# Altium project BOTS.PrjPCB
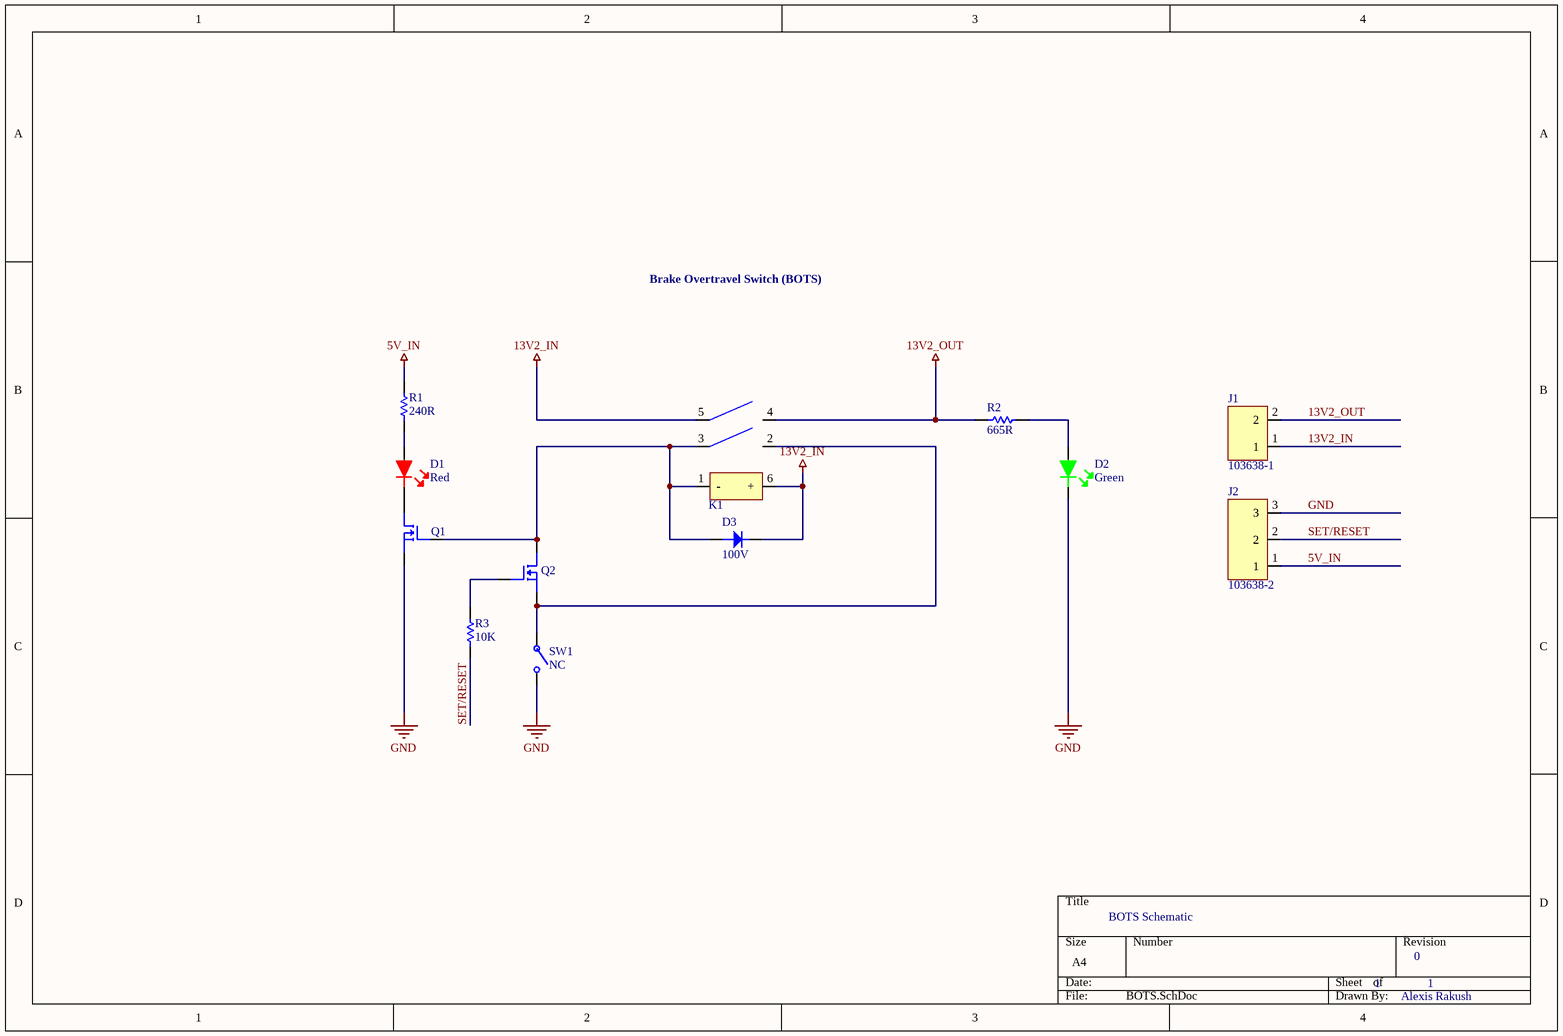
[diagram p0: BOTS.SchDoc]
1 sheet, 12 parts. Net scope: global (net labels, ports and power ports of the same name join across sheets).
Board file: BOTS.PcbDoc

## Sheet BOTS.SchDoc
size A4; Organization: Altium Limited; Address1: L3, 12a Rodborough Rd; Address2: Frenchs Forest; Address3: NSW; Address4: Australia 2086

### Parts
D1  Red  [LED-0603]
D2  Green  [LED-0603]
D3  100V  [DO-214AA]
J1  103638-1  [2PIN]
J2  103638-2  [3PIN]
K1  5-1419124-6  [RELAY DPST SDC]  (value not drawn)
Q1  DMN6140L-13DICT-ND  [SOT-23-3]  (value not drawn)
Q2  DMN6140L-13DICT-ND  [SOT-23-3]  (value not drawn)
R1  240R  [RES-0402]
R2  665R  [RES-0402]
R3  10K  [RES-0603]
SW1  NC  [Switch]

### Nets
5V_IN: J2.1 R1.2
13V2_IN: D3.1 J1.1 K1.5 K1.6(+)
13V2_OUT: J1.2 K1.4 R2.1
GND: D2.2 J2.3 Q1.3 SW1.2
SET/RESET: J2.2 R3.1
NetD1_1: D1.1 R1.1
NetD1_2: D1.2 Q1.2
NetD2_1: D2.1 R2.2
NetD3_2: D3.2 K1.1(-) K1.3 Q1.1 Q2.2
NetK1_2: K1.2 Q2.3 SW1.1
NetQ2_1: Q2.1 R3.2

### Notes on the sheet
- Brake Overtravel Switch (BOTS)
- BOTS Schematic
- 1
- 0
- Alexis Rakush
- Title
- Size:
- Date:
- A4
- Number:
- Time:
- Revision:
- Sheet
- of
- File:

### Library data of the parts
D1 = LED-Red: LED RED CLEAR 0603 SMD; Manufacturer: Wurth Electronics; Manufacturer Part Number: 150060RS75000; Viewing Angle: 140°; Lens Style: Clear,Rectangular; Luminous Intensity: 250mcd; Forward Current: 30mA; Forward Voltage: 2V; Wavelength: 625nm; Test Current: 20mA; Supplier 1: Digi-Key; Stock 1: 18518; Pricing 1: 1=0.14, 50=0.133, 100=0.114, 500=0.099 (USD); Mount: Surface Mount; Case/Package: 0603; Color: Red; Case Code (Metric): 1608; Case Code (Imperial): 0603; Min Operating Temperature: -40°C; Max Operating Temperature: 85°C; Package Quantity: 1; Packaging: Cut Tape; Dominant Wavelength: 625nm; Length: 1.6mm; Height: 0.7mm; Width: 0.8mm; REACH SVHC: Unknown; ComponentLink1URL: https://katalog.we-online.de/led/datasheet/150060RS75000.pdf?src-supplier=Digi-Key; ComponentLink1Description: https://katalog.we-online.de/led/datasheet/150060RS75000.pdf?src-supplier=Digi-Key; ComponentLink2URL: http://www.produktinfo.conrad.com/datenblaetter/750000-774999/759428-da-01-en-CHIPLED_0603_W_KL_ROT_150060RS75000.pdf?src-supplier=Conrad; ComponentLink2Description: http://www.produktinfo.conrad.com/datenblaetter/750000-774999/759428-da-01-en-CHIPLED_0603_W_KL_ROT_150060RS75000.pdf?src-supplier=Conrad; Supplier Part Number 1: 732-4978-6-ND
D2 = LED-Green: LED GREEN CLEAR 0603 SMD; Manufacturer: Wurth Electronics; Manufacturer Part Number: 150060VS75000; Luminous Intensity: 40mcd; Viewing Angle: 140°; Forward Voltage: 2V; Wavelength: 570nm; Lens Style: Clear,Rectangular; Forward Current: 30mA; Test Current: 20mA; Supplier 1: Digi-Key; Stock 1: 118118; Pricing 1: 1=0.14, 50=0.133, 100=0.114, 500=0.099 (USD); Mount: Surface Mount; Case/Package: 0603; Number of Pins: 2; Color: Green; Case Code (Metric): 1608; Case Code (Imperial): 0603; Min Operating Temperature: -40°C; Max Operating Temperature: 85°C; Package Quantity: 1; Packaging: Tape and Reel; Dominant Wavelength: 570nm; Length: 1.6mm; Height: 0.7mm; Width: 0.8mm; REACH SVHC: Unknown; ComponentLink1URL: https://katalog.we-online.de/led/datasheet/150060VS75000.pdf?src-supplier=Digi-Key; ComponentLink1Description: https://katalog.we-online.de/led/datasheet/150060VS75000.pdf?src-supplier=Digi-Key; Supplier Part Number 1: 732-4980-1-ND
D3 = Diode-100V-3A: DIODE GEN PURP 100V 3A DO214AA; Manufacturer: MCC; Manufacturer Part Number: S3BB-TP; Max Surge Current: 100A; Forward Voltage: 1.15V; Peak Reverse Current: 10uA; Element Configuration: Single; Supplier 1: Digi-Key; Stock 1: 9444; Pricing 1: 1=0.46, 10=0.376, 25=0.344, 100=0.216, 250=0.2136, 500=0.2, 1000=0.136 (USD); Mount: Surface Mount; Number of Pins: 2; Packaging: Tape and Reel; Package Quantity: 1; Average Rectified Current: 3A; Peak Non-Repetitive Surge Current: 100A; Max Repetitive Reverse Voltage (Vrrm): 100V; Reverse Voltage: 100V; Max Reverse Voltage (DC): 100V; Radiation Hardening: No; Lead Free: Lead Free; ComponentLink1URL: http://www.mccsemi.com/up_pdf/S3AB-S3MB(SMB).PDF?src-supplier=Digi-Key; ComponentLink1Description: http://www.mccsemi.com/up_pdf/S3AB-S3MB(SMB).PDF?src-supplier=Digi-Key; ComponentLink2URL: https://www.verical.com/server-webapp/html/getDatasheet?partID=686538&src-supplier=Verical; ComponentLink2Description: https://www.verical.com/server-webapp/html/getDatasheet?partID=686538&src-supplier=Verical; ComponentLink3URL: http://www.mccsemi.com/up_pdf/S3AB-S3MB(SMB).PDF?src-supplier=Future+Electronics; ComponentLink3Description: http://www.mccsemi.com/up_pdf/S3AB-S3MB(SMB).PDF?src-supplier=Future+Electronics; Supplier Part Number 1: S3BB-TPMSDKR-ND
J1 = 2PIN: CONN HEADER VERT 2POS 2.54MM; Manufacturer: TE Connectivity; Current Rating: 3A; Number of Contacts: 2; Connector Type: Plug,Header,Pin; Insulation Resistance: 5GR; Backwall/Post Interruptions: No (Without); Contact Retention: Yes (With); PCB Mount Retention: Without; PCB Mounting Orientation: Vertical; Contact Resistance: 15mR; Gender: Male; Voltage Rating: 600V; Row Spacing: 0.1inch; Plating Thickness: 2.54um; Tail Length: 3.3mm; Approvals: CSA; Supplier 1: Digi-Key; Manufacturer Part Number: 103638-1; Stock 1: 3265; Pricing 1: 1=0.77, 10=0.725, 100=0.5555, 500=0.48306, 1000=0.39852, 5000=0.35022, 10000=0.32607 (USD); Mount: Through Hole; Color: Black; Contact Plating: Gold,Tin,Lead,Matte; Contact Material: Brass; Housing Material: Thermoplastic; Housing Color: Black; Contact Shape: Square; Min Operating Temperature: -65°C; Max Operating Temperature: 105°C; Package Quantity: 72; Packaging: Rail/Tube; Termination: Crimp; Series: AMPMODU MTE; Number of Rows: 1; Orientation: Straight; Contact Gender: Male; Number of Positions: 2; Contact Current Rating: 3A; Mating Alignment: Yes (With); Mating Retention: Yes (With); PCB Mount Alignment: No (Without); Strain Relief: No (Without); Contact Type: Male Pin; Length: 7.62mm; Width: 0.3inch; Height: 13.59mm; Depth: 6.98mm; Pitch: 2.54mm; Contact Mating Length: 0.23inch; Radiation Hardening: No; Flammability Rating: UL94 V-0; ELV: Non-Compliant; Lead Free: Contains Lead; REACH SVHC: No SVHC; ComponentLink1URL: http://www.te.com/commerce/DocumentDelivery/DDEController?Action=showdoc&DocId=Data+Sheet%7F4-1773458-0_AMPMODU_MTE_INTERCONNECT_SYS%7F0810%7Fpdf%7FEnglish%7FENG_DS_4-1773458-0_AMPMODU_MTE_INTERCONNECT_SYS_0810.pdf%7F104363-8&src-supplier=Avnet; ComponentLink1Description: http://www.te.com/commerce/DocumentDelivery/DDEController?Action=showdoc&DocId=Data+Sheet%7F4-1773458-0_AMPMODU_MTE_INTERCONNECT_SYS%7F0810%7Fpdf%7FEnglish%7FENG_DS_4-1773458-0_AMPMODU_MTE_INTERCONNECT_SYS_0810.pdf%7F104363-8&src-supplier=Avnet; ComponentLink2URL: http://www.te.com/commerce/DocumentDelivery/DDEController?Action=showdoc&DocId=Data+Sheet%7F4-1773458-0_AMPMODU_MTE_INTERCONNECT_SYS%7F0411%7Fpdf%7FEnglish%7FENG_DS_4-1773458-0_AMPMODU_MTE_INTERCONNECT_SYS_0411.pdf%7F103638-1&src-supplier=Future+Electronics; ComponentLink2Description: http://www.te.com/commerce/DocumentDelivery/DDEController?Action=showdoc&DocId=Data+Sheet%7F4-1773458-0_AMPMODU_MTE_INTERCONNECT_SYS%7F0411%7Fpdf%7FEnglish%7FENG_DS_4-1773458-0_AMPMODU_MTE_INTERCONNECT_SYS_0411.pdf%7F103638-1&src-supplier=Future+Electronics; ComponentLink3URL: https://www.verical.com/server-webapp/html/getDatasheet?partID=237168&src-supplier=Verical; ComponentLink3Description: https://www.verical.com/server-webapp/html/getDatasheet?partID=237168&src-supplier=Verical; ComponentLink4URL: https://www.alliedelec.com/m/d/454cd58767cb456274f3716a0303ed50.pdf?src-supplier=Allied+Electronics; ComponentLink4Description: https://www.alliedelec.com/m/d/454cd58767cb456274f3716a0303ed50.pdf?src-supplier=Allied+Electronics; ComponentLink5URL: http://www.jameco.com/Jameco/Products/ProdDS/738013.pdf?src-supplier=Jameco; ComponentLink5Description: http://www.jameco.com/Jameco/Products/ProdDS/738013.pdf?src-supplier=Jameco; ComponentLink6URL: https://www.te.com/commerce/DocumentDelivery/DDEController?Action=srchrtrv&amp;DocNm=103638&amp;DocType=Customer+Drawing&amp;DocLang=English&src-supplier=Digi-Key; ComponentLink6Description: https://www.te.com/commerce/DocumentDelivery/DDEController?Action=srchrtrv&amp;DocNm=103638&amp;DocType=Customer+Drawing&amp;DocLang=English&src-supplier=Digi-Key; Supplier Part Number 1: A28524-ND
J2 = 3PIN: CONN HEADER VERT 3POS 2.54MM; Manufacturer: TE Connectivity; Number of Positions: 3; Insulation Resistance: 5GR; Current Rating: 3A; Connector Type: Plug,Header,Pin; Mating Alignment: Yes (With); Backwall/Post Interruptions: No (Without); PCB Mount Retention: Without; PCB Mounting Orientation: Vertical; Contact Resistance: 15mR; Gender: Male; Voltage Rating: 267V; Row Spacing: 0.1inch; Plating Thickness: 2.54um; Tail Length: 3.3mm; Approvals: CSA; Supplier 1: Digi-Key; Manufacturer Part Number: 103638-2; Stock 1: 0; Pricing 1: 1=0.8, 10=0.7, 100=0.6037, 500=0.49394, 1000=0.43905, 5000=0.38417, 10000=0.36496 (USD); Mount: Through Hole; Color: Black; Housing Color: Black; Housing Material: Thermoplastic; Contact Material: Brass; Contact Plating: Gold,Tin,Lead,Matte; Contact Shape: Square; Min Operating Temperature: -65°C; Max Operating Temperature: 105°C; Packaging: Rail/Tube; Number of Rows: 1; Package Quantity: 54; Series: AMPMODU MTE; Termination: Crimp; Number of Contacts: 3; Orientation: Straight; Contact Current Rating: 3A; Mating Retention: Yes (With); Contact Gender: Male; Contact Retention: Yes (With); PCB Mount Alignment: No (Without); Strain Relief: No (Without); Contact Type: Male Pin; Length: 0.4inch; Width: 0.4inch; Height: 13.59mm; Pitch: 2.54mm; Depth: 6.98mm; Contact Mating Length: 0.23inch; Radiation Hardening: No; Flammability Rating: UL94 V-0; ELV: Non-Compliant; Lead Free: Contains Lead; REACH SVHC: No SVHC; RoHS Compliant: No; ComponentLink1URL: http://www.te.com/commerce/DocumentDelivery/DDEController?Action=showdoc&DocId=Data+Sheet%7F4-1773458-0_AMPMODU_MTE_INTERCONNECT_SYS%7F0810%7Fpdf%7FEnglish%7FENG_DS_4-1773458-0_AMPMODU_MTE_INTERCONNECT_SYS_0810.pdf%7F104363-8&src-supplier=Avnet; ComponentLink1Description: http://www.te.com/commerce/DocumentDelivery/DDEController?Action=showdoc&DocId=Data+Sheet%7F4-1773458-0_AMPMODU_MTE_INTERCONNECT_SYS%7F0810%7Fpdf%7FEnglish%7FENG_DS_4-1773458-0_AMPMODU_MTE_INTERCONNECT_SYS_0810.pdf%7F104363-8&src-supplier=Avnet; ComponentLink2URL: http://www1.futureelectronics.com/doc/TYCO%20ELECTRONICS/103638-2.pdf?src-supplier=Future+Electronics; ComponentLink2Description: http://www1.futureelectronics.com/doc/TYCO%20ELECTRONICS/103638-2.pdf?src-supplier=Future+Electronics; ComponentLink3URL: https://www.verical.com/server-webapp/html/getDatasheet?partID=198760&src-supplier=Verical; ComponentLink3Description: https://www.verical.com/server-webapp/html/getDatasheet?partID=198760&src-supplier=Verical; ComponentLink4URL: http://www.te.com/commerce/DocumentDelivery/DDEController?Action=showdoc&DocId=Data+Sheet%7F4-1773458-0_AMPMODU_MTE_INTERCONNECT_SYS%7F0810%7Fpdf%7FEnglish%7FENG_DS_4-1773458-0_AMPMODU_MTE_INTERCONNECT_SYS_0810.pdf%7F104363-8&src-supplier=Avnet+Asia; ComponentLink4Description: http://www.te.com/commerce/DocumentDelivery/DDEController?Action=showdoc&DocId=Data+Sheet%7F4-1773458-0_AMPMODU_MTE_INTERCONNECT_SYS%7F0810%7Fpdf%7FEnglish%7FENG_DS_4-1773458-0_AMPMODU_MTE_INTERCONNECT_SYS_0810.pdf%7F104363-8&src-supplier=Avnet+Asia; ComponentLink5URL: https://www.alliedelec.com/m/d/494b66edc3896904f54da7132ef2a22d.pdf?src-supplier=Allied+Electronics; ComponentLink5Description: https://www.alliedelec.com/m/d/494b66edc3896904f54da7132ef2a22d.pdf?src-supplier=Allied+Electronics; ComponentLink6URL: http://www.jameco.com/Jameco/Products/ProdDS/738021.pdf?src-supplier=Jameco; ComponentLink6Description: http://www.jameco.com/Jameco/Products/ProdDS/738021.pdf?src-supplier=Jameco; ComponentLink7URL: http://www.te.com/commerce/DocumentDelivery/DDEController?Action=srchrtrv&DocNm=103638&DocType=Customer+Drawing&DocLang=English&src-supplier=Digi-Key; ComponentLink7Description: http://www.te.com/commerce/DocumentDelivery/DDEController?Action=srchrtrv&DocNm=103638&DocType=Customer+Drawing&DocLang=English&src-supplier=Digi-Key; Supplier Part Number 1: A28527-ND
K1 = 5-1419124-6: General Purpose Relay, Osa Series, Power, Non Latching, Dpst-No, 12 Vdc, 3 A Rohs Compliant: Yes; Manufacturer: TE Connectivity; Contact Current Rating: 3A; Coil Current: 45mA; Throw Configuration: DPST; Operate Time: 20ms; Release Time: 10ms; Coil Power: 600mW; Coil Resistance: 270R; Coil Type: Non-Latching; Coil Voltage (DC): 12V; Contact Voltage Rating (AC): 240V; Supplier 1: Digi-Key; Manufacturer Part Number: 5-1419124-6; Stock 1: 2593; Pricing 1: 1=2.54, 10=2.385, 25=2.1204, 50=2.0142, 100=1.9083, 250=1.69624, 500=1.59022, 1000=1.48421, 5000=1.4312 (USD); Mount: Through Hole; Weight: 13g; Contact Material: Silver; Min Operating Temperature: -30°C; Max Operating Temperature: 60°C; Package Quantity: 1000; Packaging: Box; Termination: PCB; Relay Type: General Purpose; Length: 24.4mm; Height: 0.976inch; Width: 12.9mm; ELV: Compliant; REACH SVHC: Unknown; ComponentLink1URL: http://www.farnell.com/datasheets/1652820.pdf?src-supplier=Farnell; ComponentLink1Description: http://www.farnell.com/datasheets/1652820.pdf?src-supplier=Farnell; ComponentLink2URL: http://www.farnell.com/cad/1652820.pdf?src-supplier=Element14; ComponentLink2Description: http://www.farnell.com/cad/1652820.pdf?src-supplier=Element14; ComponentLink3URL: http://www.te.com/commerce/DocumentDelivery/DDEController?Action=srchrtrv&DocNm=5-1419124-6&DocType=Customer+Drawing&DocLang=English&src-supplier=Digi-Key; ComponentLink3Description: http://www.te.com/commerce/DocumentDelivery/DDEController?Action=srchrtrv&DocNm=5-1419124-6&DocType=Customer+Drawing&DocLang=English&src-supplier=Digi-Key; Supplier Part Number 1: OSA-SS-212DM3,000-ND; Category: Relays
Q1 Q2 = N-FET-60V-1.6A: MOSFET N-CH 60V 1.6A SOT23; Manufacturer: Diodes; Rds On Max: 140mR; Input Capacitance: 315pF; Max Power Dissipation: 700mW; Supplier 1: Digi-Key; Manufacturer Part Number: DMN6140L-13; Stock 1: 274948; Pricing 1: 1=0.34, 10=0.256, 25=0.224, 100=0.1217, 250=0.12104, 500=0.09926, 1000=0.07365, 2500=0.06468, 5000=0.05924 (USD); Mount: Surface Mount; Case/Package: TO-236-3; Min Operating Temperature: -55°C; Max Operating Temperature: 150°C; Package Quantity: 10000; Packaging: Cut Tape; Drain to Source Voltage (Vdss): 60V; Continuous Drain Current (ID): 1.6A; ComponentLink1URL: https://www.diodes.com/assets/Datasheets/DMN6140L.pdf?src-supplier=Digi-Key; ComponentLink1Description: https://www.diodes.com/assets/Datasheets/DMN6140L.pdf?src-supplier=Digi-Key; Supplier Part Number 1: DMN6140L-13DIDKR-ND
R1 = 0402-240R: RES SMD 240 OHM 1% 1/10W 0402; Manufacturer: Panasonic; Manufacturer Part Number: ERJ-2RKF2400X; Power Rating: 100mW; Voltage Rating: 50V; Temperature Coefficient: 100ppm/°C; Supplier 1: Digi-Key; Stock 1: 1048092; Pricing 1: 1=0.1, 10=0.04, 100=0.0162, 1000=0.00729, 2500=0.00632, 5000=0.00523 (USD); Mount: Surface Mount; Case/Package: 0402; Case Code (Metric): 1005; Case Code (Imperial): 0402; Contact Plating: Tin; Min Operating Temperature: -55°C; Max Operating Temperature: 155°C; Resistance: 240R; Tolerance: 1%; Packaging: Tape and Reel; Package Quantity: 1; Composition: Thick Film; Number of Terminations: 2; Termination: SMD/SMT; Military Standard: Not; Max Power Dissipation: 100mW; Voltage Rating (DC): 50V; Features: Automotive AEC-Q200; Working Voltage: 50V; Length: 1mm; Height: 0.35mm; Width: 0.02inch; Depth: 0.5mm; Radiation Hardening: No; REACH SVHC: No SVHC; Lead Free: Lead Free; ComponentLink1URL: http://www.farnell.com/datasheets/426256.pdf?src-supplier=Element14; ComponentLink1Description: http://www.farnell.com/datasheets/426256.pdf?src-supplier=Element14; ComponentLink2URL: http://industrial.panasonic.com/www-data/pdf/AOA0000/AOA0000CE2.pdf?src-supplier=Avnet; ComponentLink2Description: http://industrial.panasonic.com/www-data/pdf/AOA0000/AOA0000CE2.pdf?src-supplier=Avnet; ComponentLink3URL: http://www.mouser.com/ds/2/315/AOA0000CE2-37512.pdf?src-supplier=Mouser; ComponentLink3Description: http://www.mouser.com/ds/2/315/AOA0000CE2-37512.pdf?src-supplier=Mouser; ComponentLink4URL: http://www.farnell.com/datasheets/1678782.pdf?src-supplier=Element14; ComponentLink4Description: http://www.farnell.com/datasheets/1678782.pdf?src-supplier=Element14; ComponentLink5URL: https://www.alliedelec.com/m/d/623f45ff1957d936ff56d46fd1c28cac.pdf?src-supplier=Allied+Electronics; ComponentLink5Description: https://www.alliedelec.com/m/d/623f45ff1957d936ff56d46fd1c28cac.pdf?src-supplier=Allied+Electronics; ComponentLink6URL: http://industrial.panasonic.com/cdbs/www-data/pdf/RDA0000/AOA0000C304.pdf?src-supplier=Farnell; ComponentLink6Description: http://industrial.panasonic.com/cdbs/www-data/pdf/RDA0000/AOA0000C304.pdf?src-supplier=Farnell; ComponentLink7URL: http://www.farnell.com/datasheets/1911175.pdf?src-supplier=Farnell; ComponentLink7Description: http://www.farnell.com/datasheets/1911175.pdf?src-supplier=Farnell; Supplier Part Number 1: P240LCT-ND
R2 = 0402-665R: RES SMD 665 OHM 1% 1/10W 0402; Manufacturer: Panasonic; Manufacturer Part Number: ERJ-2RKF6650X; Power Rating: 100mW; Voltage Rating: 50V; Temperature Coefficient: 100ppm/°C; Supplier 1: Digi-Key; Stock 1: 233494; Pricing 1: 1=0.1, 10=0.041, 100=0.0167, 1000=0.00751, 2500=0.00652, 5000=0.00538 (USD); Mount: Surface Mount; Case/Package: 0402; Weight: 2.8E-05oz; Case Code (Metric): 1005; Case Code (Imperial): 0402; Contact Plating: Tin; Min Operating Temperature: -55°C; Max Operating Temperature: 155°C; Resistance: 665R; Packaging: Tape and Reel; Tolerance: 1%; Package Quantity: 1; Composition: Thick Film; Number of Terminations: 2; Termination: SMD/SMT; Military Standard: Not; Max Power Dissipation: 100mW; Voltage Rating (DC): 50V; Features: Automotive AEC-Q200; Length: 1mm; Height: 0.35mm; Width: 0.02inch; Depth: 0.5mm; REACH SVHC: No SVHC; ComponentLink1URL: http://www.industrial.panasonic.com/www-data/pdf/AOA0000/AOA0000CE2.pdf?src-supplier=Element14; ComponentLink1Description: http://www.industrial.panasonic.com/www-data/pdf/AOA0000/AOA0000CE2.pdf?src-supplier=Element14; ComponentLink2URL: http://www.farnell.com/datasheets/1678782.pdf?src-supplier=Element14; ComponentLink2Description: http://www.farnell.com/datasheets/1678782.pdf?src-supplier=Element14; ComponentLink3URL: https://www.alliedelec.com/m/d/623f45ff1957d936ff56d46fd1c28cac.pdf?src-supplier=Allied+Electronics; ComponentLink3Description: https://www.alliedelec.com/m/d/623f45ff1957d936ff56d46fd1c28cac.pdf?src-supplier=Allied+Electronics; ComponentLink4URL: http://www.farnell.com/datasheets/1678782.pdf?src-supplier=Farnell; ComponentLink4Description: http://www.farnell.com/datasheets/1678782.pdf?src-supplier=Farnell; ComponentLink5URL: http://industrial.panasonic.com/www-data/pdf/AOA0000/AOA0000CE2.pdf?src-supplier=Avnet; ComponentLink5Description: http://industrial.panasonic.com/www-data/pdf/AOA0000/AOA0000CE2.pdf?src-supplier=Avnet; ComponentLink6URL: http://www.mouser.com/ds/2/315/AOA0000C304-1149620.pdf?src-supplier=Mouser; ComponentLink6Description: http://www.mouser.com/ds/2/315/AOA0000C304-1149620.pdf?src-supplier=Mouser; Supplier Part Number 1: P665LDKR-ND
R3 = 0603-10KR: RES SMD 10K OHM 5% 1/10W 0603; Manufacturer: Yageo; Manufacturer Part Number: RC0603JR-0710KL; Resistance: 10kR; Voltage Rating (DC): 50V; Temperature Coefficient: 100ppm/°C; Power Rating: 100mW; Supplier 1: Digi-Key; Stock 1: 3006558; Pricing 1: 1=0.1, 10=0.019, 100=0.0077, 1000=0.00347, 2500=0.00301 (USD); Case/Package: 0603; Number of Pins: 2; Contact Plating: Tin,Matte; Case Code (Imperial): 0603; Case Code (Metric): 1608; Min Operating Temperature: -55°C; Max Operating Temperature: 155°C; Packaging: Tape and Reel; Tolerance: 5%; Composition: Thick Film; Voltage Rating: 50V; Termination: SMD/SMT; Military Standard: Not; Features: Moisture Resistant; Max Power Dissipation: 100mW; Number of Terminations: 2; Length: 0.063inch; Width: 0.031inch; Depth: 0.8mm; Height - Seated (Max): 0.022inch; Radiation Hardening: No; REACH SVHC: Unknown; Lead Free: Lead Free; ComponentLink1URL: http://www.yageo.com/documents/recent/PYu-RC_Group_51_RoHS_L_10.pdf?src-supplier=Digi-Key; ComponentLink1Description: http://www.yageo.com/documents/recent/PYu-RC_Group_51_RoHS_L_10.pdf?src-supplier=Digi-Key; Supplier Part Number 1: 311-10KGRDKR-ND
SW1 = Switch: SWITCH SNAP ACT SPST-NC 5A 125V; Manufacturer: Omron; Manufacturer Part Number: SS-5GL-F-2T; Mechanical Life: 30000000Cycles; Voltage Rating (DC): 30V; Throw Configuration: SPST; Operating Force: 0.16N; Max Voltage Rating (DC): 14V; Current Rating: 4A; Electrical Life: 200000Cycles; Differential Travel: 0.031inch; Overtravel: 0.047inch; Operating Position: 0.345inch; Switch Function: On-Mom; Ratings: IP40; Supplier 1: Digi-Key; Stock 1: 392; Pricing 1: 1=1.99, 10=1.836, 25=1.7216, 50=1.6832, 100=1.3389, 250=1.26236, 500=1.18586, 1000=1.10936, 5000=1.03285 (USD); Mount: Chassis Mount,Screw; Contact Material: Silver; Min Operating Temperature: -25°C; Max Operating Temperature: 85°C; Voltage Rating (AC): 125V; Packaging: Bulk; Max Voltage Rating (AC): 125V; Package Quantity: 500; Termination: Quick Connect; Orientation: Straight; Series: SS; Radiation Hardening: No; RoHS Compliant: Yes; ComponentLink1URL: https://www.components.omron.com/components/web/pdflib.nsf/0/80FC48E7A8A557A885257201007DD493/$file/SS_1110.pdf?src-supplier=Avnet; ComponentLink1Description: https://www.components.omron.com/components/web/pdflib.nsf/0/80FC48E7A8A557A885257201007DD493/$file/SS_1110.pdf?src-supplier=Avnet; ComponentLink2URL: http://www.components.omron.com/components/web/PDFLIB.nsf/0/80FC48E7A8A557A885257201007DD493/$file/SS_1110.pdf?src-supplier=Digi-Key; ComponentLink2Description: http://www.components.omron.com/components/web/PDFLIB.nsf/0/80FC48E7A8A557A885257201007DD493/$file/SS_1110.pdf?src-supplier=Digi-Key; Supplier Part Number 1: Z4584-ND